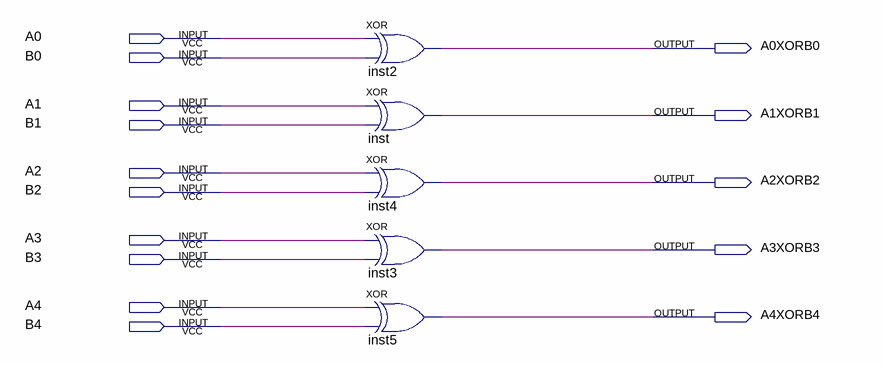
[diagram p0: schematic sheet]
// Quartus schematic A_XOR_B.bdf as structural Verilog: 5 symbols, 15 pins
module A_XOR_B (
  input  A0,
  input  B0,
  input  A1,
  input  B1,
  input  A2,
  input  B2,
  input  A3,
  input  B3,
  input  A4,
  input  B4,
  output A0XORB0,
  output A1XORB1,
  output A2XORB2,
  output A3XORB3,
  output A4XORB4
);

  xor inst2 (A0XORB0, A0, B0);
  xor inst (A1XORB1, A1, B1);
  xor inst4 (A2XORB2, A2, B2);
  xor inst3 (A3XORB3, A3, B3);
  xor inst5 (A4XORB4, A4, B4);
endmodule
